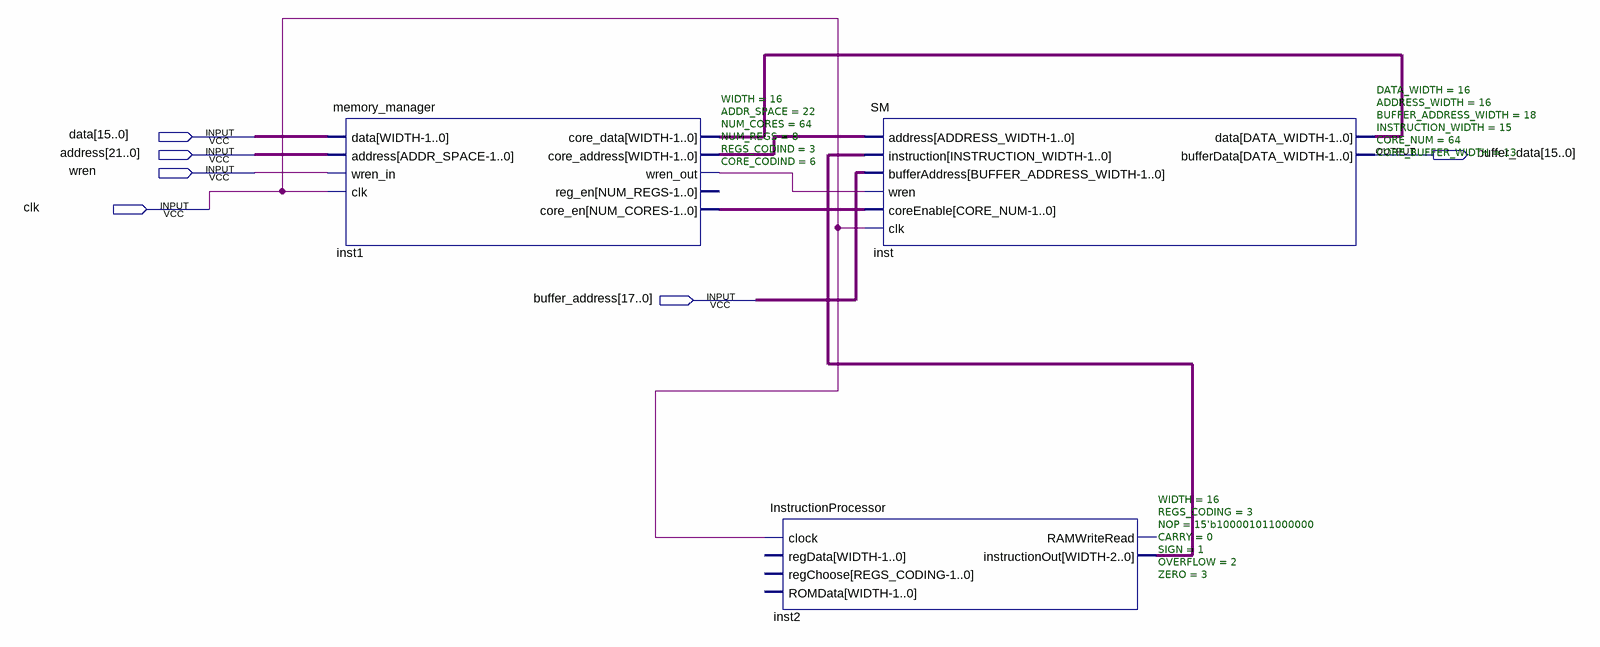
[diagram p0: schematic sheet]
// Quartus schematic videocard.bdf as structural Verilog: 3 symbols, 6 pins
module videocard (
  input  [15:0] data,
  input  [21:0] address,
  input  wren,
  input  clk,
  input  [17:0] buffer_address,
  output [15:0] buffer_data
);

  wire inst1_wren_out;
  wire [14:0] inst2_instructionout;
  wire [15:0] inst1_core_address, inst1_core_data;
  wire [63:0] inst1_core_en;

  memory_manager #(.WIDTH(16), .ADDR_SPACE(22), .NUM_CORES(64), .NUM_REGS(8), .REGS_CODIND(3), .CORE_CODIND(6)) inst1 (
    .data(data), .address(address), .wren_in(wren), .clk(clk), .core_data(inst1_core_data),
    .core_address(inst1_core_address), .wren_out(inst1_wren_out), .core_en(inst1_core_en));  // open: reg_en
  InstructionProcessor #(.WIDTH(16), .REGS_CODING(3), .NOP(15'b100001011000000), .CARRY(0), .SIGN(1), .OVERFLOW(2), .ZERO(3)) inst2 (
    .clock(clk), .instructionOut(inst2_instructionout));  // open: regData, regChoose, ROMData, RAMWriteRead
  SM #(.DATA_WIDTH(16), .ADDRESS_WIDTH(16), .BUFFER_ADDRESS_WIDTH(18), .INSTRUCTION_WIDTH(15), .CORE_NUM(64), .CORE_BUFFER_WIDTH(13)) inst (
    .address(inst1_core_address), .instruction(inst2_instructionout), .bufferAddress(buffer_address),
    .wren(inst1_wren_out), .coreEnable(inst1_core_en), .clk(clk), .bufferData(buffer_data),
    .data(inst1_core_data));
endmodule
